# EAGLE schematic boomer (EAGLE 9.6.2)
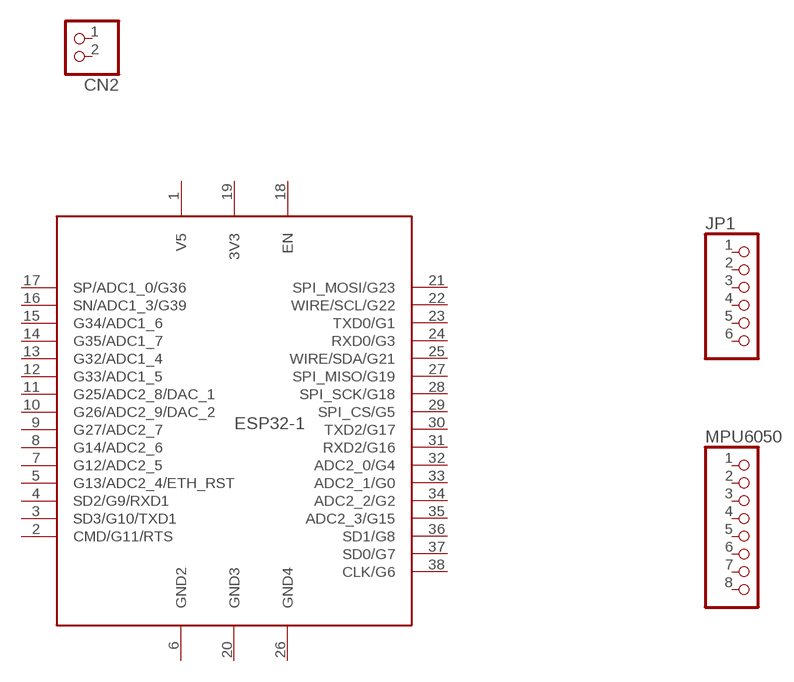
[diagram p0: schematic, sheet 1]

## Parts
CN2  JST_2PIN-THM  [JST-PH-2-THM]
ESP32-1  NODEMCU_ESP32_WROOM_32  [NODEMCU_ESP32_WROOM_32--38PINS]
JP1  PINHD-1X6  [1X06]
MPU6050  PINHD-1X8BIG  [1X08-BIG]
Unconnected: CN2.1 CN2.2 ESP32-1.3(SD3/G10/TXD1) ESP32-1.4(SD2/G9/RXD1) ESP32-1.5(G13/ADC2_4/ETH_RST) ESP32-1.7(G12/ADC2_5) ESP32-1.8(G14/ADC2_6) ESP32-1.9(G27/ADC2_7) ESP32-1.10(G26/ADC2_9/DAC_2) ESP32-1.11(G25/ADC2_8/DAC_1) ESP32-1.12(G33/ADC1_5) ESP32-1.13(G32/ADC1_4) ESP32-1.14(G35/ADC1_7) ESP32-1.15(G34/ADC1_6) ESP32-1.16(SN/ADC1_3/G39) ESP32-1.17(SP/ADC1_0/G36) ESP32-1.18(EN) ESP32-1.21(SPI_MOSI/G23) ESP32-1.22(WIRE/SCL/G22) ESP32-1.23(TXD0/G1) ESP32-1.24(RXD0/G3) ESP32-1.25(WIRE/SDA/G21) ESP32-1.27(SPI_MISO/G19) ESP32-1.28(SPI_SCK/G18) ESP32-1.29(SPI_CS/G5) ESP32-1.30(TXD2/G17) ESP32-1.31(RXD2/G16) ESP32-1.32(ADC2_0/G4) ESP32-1.33(ADC2_1/G0) ESP32-1.34(ADC2_2/G2) ESP32-1.35(ADC2_3/G15) ESP32-1.36(SD1/G8) ESP32-1.37(SD0/G7) ESP32-1.38(CLK/G6) JP1.1 JP1.2 JP1.3 JP1.4 JP1.5 JP1.6 MPU6050.1 MPU6050.2 MPU6050.3 MPU6050.4 MPU6050.5 MPU6050.6 MPU6050.7 MPU6050.8

## Power pins joined to a net without a drawn wire
3V3: ESP32-1.19(3V3)
CMD/G11/RTS: ESP32-1.2(CMD/G11/RTS)
GND2: ESP32-1.6(GND2)
GND3: ESP32-1.20(GND3)
GND4: ESP32-1.26(GND4)
V5: ESP32-1.1(V5)

## Library data of the parts
CN2 = adafruit:JST_2PIN: JST 2-Pin Connectors of various flavors SMT-RA (S2B-PH-SM4) 4UConnector #17311 SMT (B2B-PH-SM4) THM-RA (S2B-PH) THM (B2B-PH)
ESP32-1 = ESP32 NODEMCU WROOM 32:NODEMCU_ESP32_WROOM_32: NODEMCU ESP32 WROOM 32 38 Pins PINOUT: https://cdn.shopify.com/s/files/1/1509/1638/files/ESP_-_32_NodeMCU_Developmentboard_Pinout_Diagram.jpg?4479111012146266271; ESP: ESP32 WROOM 32
JP1 = adafruit:PINHD-1X6: PIN HEADER
MPU6050 = adafruit:PINHD-1X8: PIN HEADER